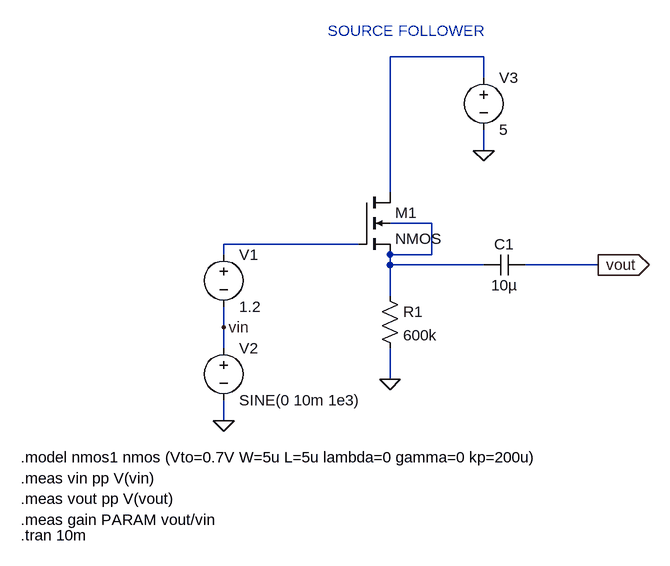
[diagram p0: schematic SOURCE FOLLOWER.asc]
SOURCE FOLLOWER.asc, the LTspice schematic file:
Version 4
SHEET 1 880 680
WIRE 384 -96 240 -96
WIRE 384 -64 384 -96
WIRE 384 48 384 16
WIRE 240 112 240 -96
WIRE 304 160 240 160
WIRE 192 192 -16 192
WIRE -16 208 -16 192
WIRE 304 208 304 160
WIRE 304 208 240 208
WIRE 240 224 240 208
WIRE 384 224 240 224
WIRE 560 224 448 224
WIRE 240 272 240 224
WIRE -16 320 -16 288
WIRE -16 352 -16 320
WIRE 240 400 240 352
WIRE -16 464 -16 432
FLAG 384 48 0
FLAG -16 464 0
FLAG 240 400 0
FLAG 560 224 vout
IOPIN 560 224 Out
FLAG -16 320 vin
SYMBOL nmos4 192 112 R0
SYMATTR InstName M1
SYMBOL voltage -16 192 R0
WINDOW 123 0 0 Left 0
WINDOW 39 0 0 Left 0
SYMATTR InstName V1
SYMATTR Value 1.2
SYMBOL voltage -16 336 R0
WINDOW 123 0 0 Left 0
WINDOW 39 0 0 Left 0
SYMATTR InstName V2
SYMATTR Value SINE(0 10m 1e3)
SYMBOL voltage 384 -80 R0
WINDOW 123 0 0 Left 0
WINDOW 39 0 0 Left 0
SYMATTR InstName V3
SYMATTR Value 5
SYMBOL res 224 256 R0
SYMATTR InstName R1
SYMATTR Value 600k
SYMBOL cap 448 208 R90
WINDOW 0 0 32 VBottom 2
WINDOW 3 32 32 VTop 2
SYMATTR InstName C1
SYMATTR Value 10µ
TEXT -328 520 Left 2 !.model nmos1 nmos (Vto=0.7V W=5u L=5u lambda=0 gamma=0 kp=200u)
TEXT -328 552 Left 2 !.meas vin pp V(vin)
TEXT -328 584 Left 2 !.meas vout pp V(vout)
TEXT -328 616 Left 2 !.meas gain PARAM vout/vin
TEXT -328 640 Left 2 !.tran 10m
TEXT 144 -136 Left 2 ;SOURCE FOLLOWER

The netlist it stands for:
* SOURCE FOLLOWER.asc
M1 N001 N003 N002 N002 NMOS
V1 N003 vin 1.2
V2 vin 0 SINE(0 10m 1e3)
V3 N001 0 5
R1 N002 0 600k
C1 vout N002 10µ
.model NMOS NMOS
.model PMOS PMOS
.lib standard.mos
.model nmos1 nmos (Vto=0.7V W=5u L=5u lambda=0 gamma=0 kp=200u)
.meas vin pp V(vin)
.meas vout pp V(vout)
.meas gain PARAM vout/vin
.tran 10m
* SOURCE FOLLOWER
.backanno
.end